# Altium schematic sheet driverboard.SchDoc
size A4
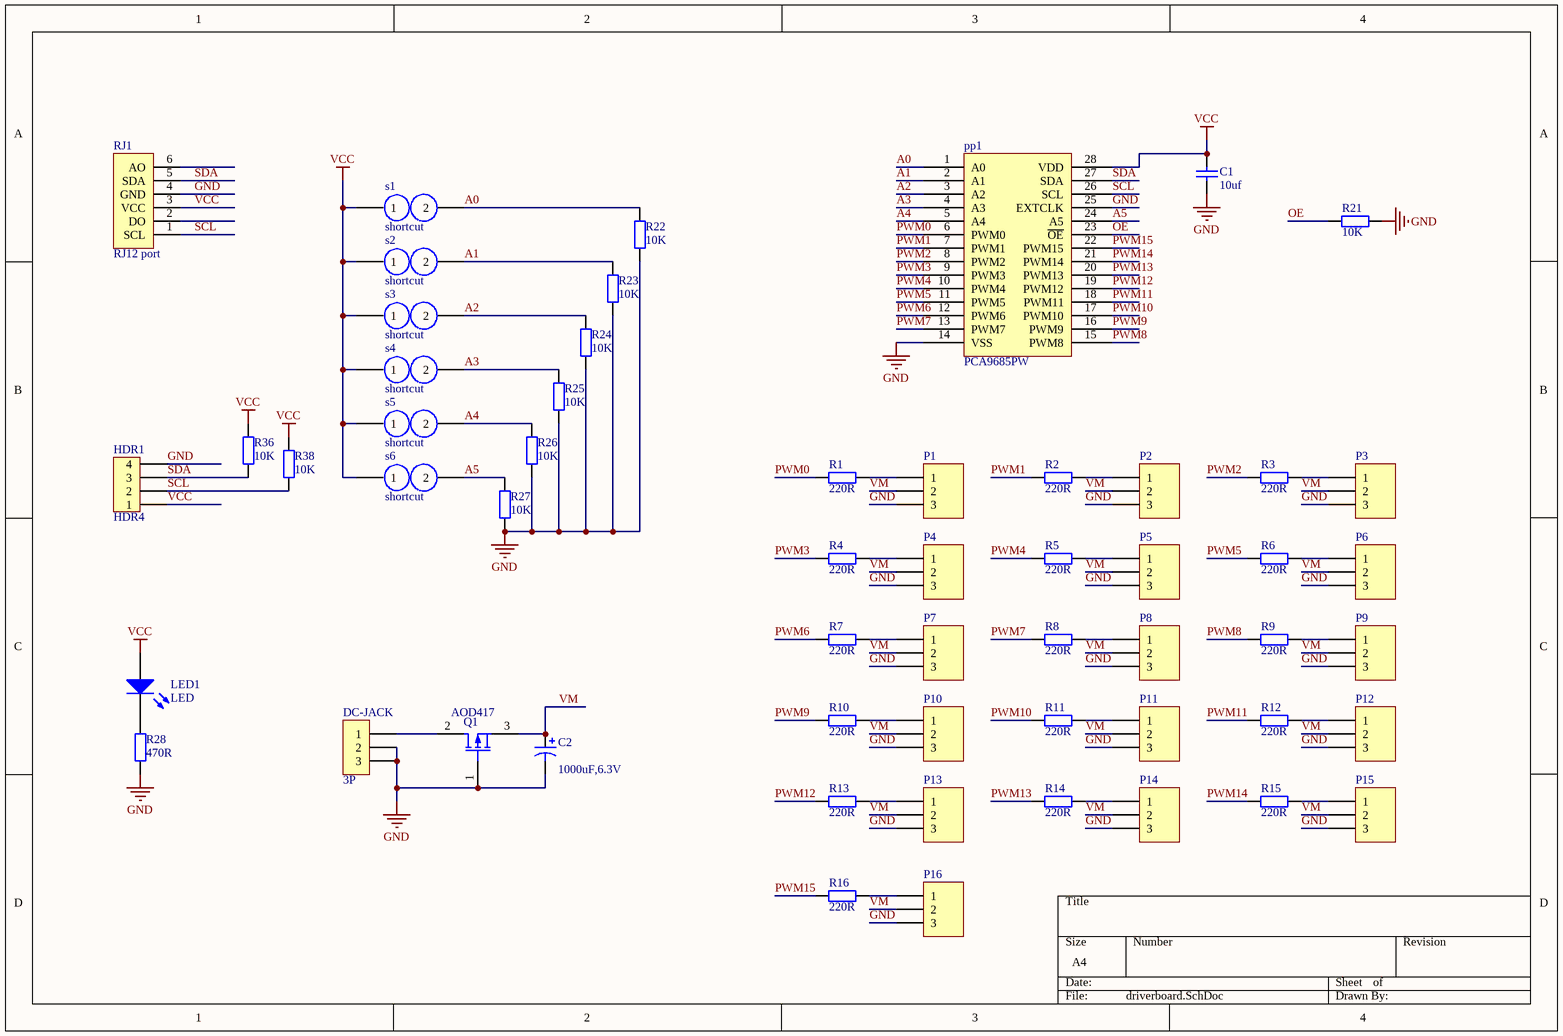
[diagram p0: driverboard.SchDoc]

## Parts
C1  value 10uf  [C0805]  (hidden comment: Capacitor)
C2  value 1000uF,6.3V  [TC7343-E]  (hidden comment: Cap Pol3)
DC-JACK  3P  [DC-JACK-005]
HDR1  HDR4  [HDR1X4]
LED1  LED  [C0603]
P1  Header 3H  [HDR1X3]  (value not drawn)
P2  Header 3H  [HDR1X3]  (value not drawn)
P3  Header 3H  [HDR1X3]  (value not drawn)
P4  Header 3H  [HDR1X3]  (value not drawn)
P5  Header 3H  [HDR1X3]  (value not drawn)
P6  Header 3H  [HDR1X3]  (value not drawn)
P7  Header 3H  [HDR1X3]  (value not drawn)
P8  Header 3H  [HDR1X3]  (value not drawn)
P9  Header 3H  [HDR1X3]  (value not drawn)
P10  Header 3H  [HDR1X3]  (value not drawn)
P11  Header 3H  [HDR1X3]  (value not drawn)
P12  Header 3H  [HDR1X3]  (value not drawn)
P13  Header 3H  [HDR1X3]  (value not drawn)
P14  Header 3H  [HDR1X3]  (value not drawn)
P15  Header 3H  [HDR1X3]  (value not drawn)
P16  Header 3H  [HDR1X3]  (value not drawn)
pp1  PCA9685PW  [TSSOP-28]
Q1  AOD417  [TO-252]
R1  value 220R  [R0603]  (hidden comment: Resistor)
R2  value 220R  [R0603]  (hidden comment: Resistor)
R3  value 220R  [R0603]  (hidden comment: Resistor)
R4  value 220R  [R0603]  (hidden comment: Resistor)
R5  value 220R  [R0603]  (hidden comment: Resistor)
R6  value 220R  [R0603]  (hidden comment: Resistor)
R7  value 220R  [R0603]  (hidden comment: Resistor)
R8  value 220R  [R0603]  (hidden comment: Resistor)
R9  value 220R  [R0603]  (hidden comment: Resistor)
R10  value 220R  [R0603]  (hidden comment: Resistor)
R11  value 220R  [R0603]  (hidden comment: Resistor)
R12  value 220R  [R0603]  (hidden comment: Resistor)
R13  value 220R  [R0603]  (hidden comment: Resistor)
R14  value 220R  [R0603]  (hidden comment: Resistor)
R15  value 220R  [R0603]  (hidden comment: Resistor)
R16  value 220R  [R0603]  (hidden comment: Resistor)
R21  value 10K  [R0603]  (hidden comment: Resistor)
R22  value 10K  [R0603]  (hidden comment: Resistor)
R23  value 10K  [R0603]  (hidden comment: Resistor)
R24  value 10K  [R0603]  (hidden comment: Resistor)
R25  value 10K  [R0603]  (hidden comment: Resistor)
R26  value 10K  [R0603]  (hidden comment: Resistor)
R27  value 10K  [R0603]  (hidden comment: Resistor)
R28  value 470R  [R0603]  (hidden comment: Resistor)
R36  value 10K  [R0603]  (hidden comment: Resistor)
R38  value 10K  [R0603]  (hidden comment: Resistor)
RJ1  RJ12 port  [RJ12-S-12X15X14.5]
s1  shortcut  [C0603]
s2  shortcut  [C0603]
s3  shortcut  [C0603]
s4  shortcut  [C0603]
s5  shortcut  [C0603]
s6  shortcut  [C0603]

## Nets
GND: C1.1 C2.2 DC-JACK.2 DC-JACK.3 HDR1.4 P1.3 P2.3 P3.3 P4.3 P5.3 P6.3 P7.3 P8.3 P9.3 P10.3 P11.3 P12.3 P13.3 P14.3 P15.3 P16.3 pp1.14(VSS) pp1.25(EXTCLK) Q1.1(G) R21.1 R22.1 R23.1 R24.1 R25.1 R26.1 R27.1 R28.1 RJ1.4(GND)
VCC: C1.2 HDR1.1 LED1.1(A) pp1.28(VDD) R36.2 R38.2 RJ1.3(VCC) s1.1 s2.1 s3.1 s4.1 s5.1 s6.1
A0: pp1.1(A0) R22.2 s1.2
A1: pp1.2(A1) R23.2 s2.2
A2: pp1.3(A2) R24.2 s3.2
A3: pp1.4(A3) R25.2 s4.2
A4: pp1.5(A4) R26.2 s5.2
A5: pp1.24(A5) R27.2 s6.2
OE: pp1.23(~{OE}) R21.2
PWM0: pp1.6(PWM0) R1.2
PWM1: pp1.7(PWM1) R2.2
PWM2: pp1.8(PWM2) R3.2
PWM3: pp1.9(PWM3) R4.2
PWM4: pp1.10(PWM4) R5.2
PWM5: pp1.11(PWM5) R6.2
PWM6: pp1.12(PWM6) R7.2
PWM7: pp1.13(PWM7) R8.2
PWM8: pp1.15(PWM8) R9.2
PWM9: pp1.16(PWM9) R10.2
PWM10: pp1.17(PWM10) R11.2
PWM11: pp1.18(PWM11) R12.2
PWM12: pp1.19(PWM12) R13.2
PWM13: pp1.20(PWM13) R14.2
PWM14: pp1.21(PWM14) R15.2
PWM15: pp1.22(PWM15) R16.2
SCL: HDR1.2 pp1.26(SCL) R38.1 RJ1.1(SCL)
SDA: HDR1.3 pp1.27(SDA) R36.1 RJ1.5(SDA)
VM: C2.1 P1.2 P2.2 P3.2 P4.2 P5.2 P6.2 P7.2 P8.2 P9.2 P10.2 P11.2 P12.2 P13.2 P14.2 P15.2 P16.2 Q1.3(S)
NetDC-JACK_1: DC-JACK.1 Q1.2(D)
NetLED1_2: LED1.2(K) R28.2
NetP1_1: P1.1 R1.1
NetP2_1: P2.1 R2.1
NetP3_1: P3.1 R3.1
NetP4_1: P4.1 R4.1
NetP5_1: P5.1 R5.1
NetP6_1: P6.1 R6.1
NetP7_1: P7.1 R7.1
NetP8_1: P8.1 R8.1
NetP9_1: P9.1 R9.1
NetP10_1: P10.1 R10.1
NetP11_1: P11.1 R11.1
NetP12_1: P12.1 R12.1
NetP13_1: P13.1 R13.1
NetP14_1: P14.1 R14.1
NetP15_1: P15.1 R15.1
NetP16_1: P16.1 R16.1

Not connected (* = marked no-connect by the designer): RJ1 2(DO) 6(AO)

## Library data of the parts
C2 = Cap Pol3: Polarized Capacitor (Surface Mount); Published: 8-Jun-2000; LatestRevisionDate: 29-May-2009; LatestRevisionNote: IPC-7351 Footprint Added.; PackageReference: C0805; Publisher: Altium Limited; PackageDescription: Chip Capacitor
HDR1 = HDR4-2.54mm: Header  4pin
LED1 = LED-SM: LED  SMD
P1-P16 = Header 3H: Header, 3-Pin, Right Angle; LatestRevisionDate: 17-Jul-2002; LatestRevisionNote: Re-released for DXP Platform.; Publisher: Altium Limited
Q1 = MOSFET-P: P-Channel MOSFET; Published: 8-Jun-2000; LatestRevisionDate: 17-Jul-2002; LatestRevisionNote: Re-released for DXP Platform.; PackageVersion: 1995/1996; PackageReference: E3; Publisher: Altium Limited; PackageDescription: TO, Flat Index; 3 In-Line, Axial Leads; Body Dia. 4.6mm; Lead Dia. 0.5 mm (max)
RJ1 = RJ12
C1 = Capacitor: Published: 8-Jun-2000; LatestRevisionDate: 17-Jul-2002; LatestRevisionNote: Re-released for DXP Platform.; PackageReference: RAD-0.3; Publisher: Altium Limited; PackageDescription: Radial Cap, Thru-Hole; 2 Leads; 0.3 in Pin Spacing
R1-R16 R21-R28 R36 R38 = Resistor: Published: 8-Jun-2000; LatestRevisionDate: 17-Jul-2002; LatestRevisionNote: Re-released for DXP Platform.; PackageReference: AXIAL-0.4; Publisher: Altium Limited; PackageDescription: Axial Device, Thru-Hole; 2 Leads; 0.4 in Pin Spacing